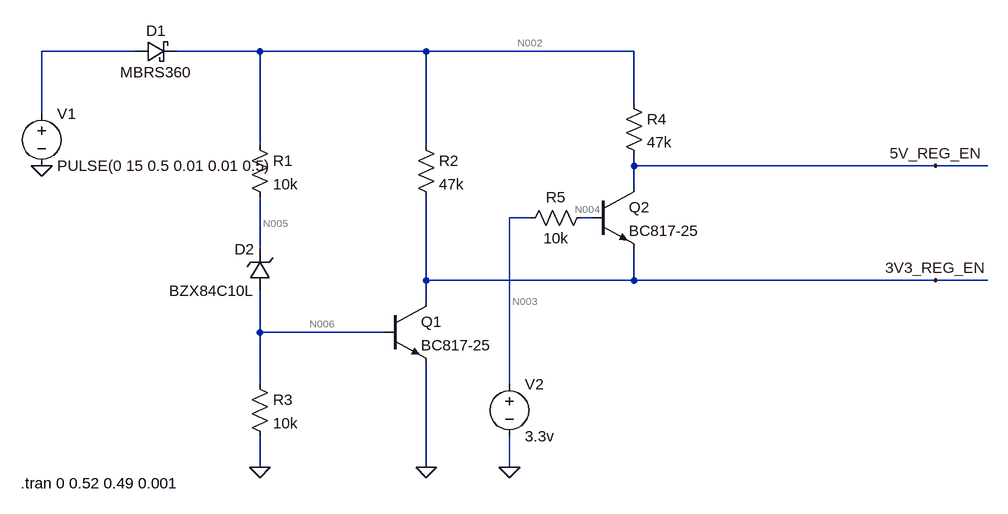
[diagram p0: schematic psu.asc]
psu.asc, the LTspice schematic file:
Version 4
SHEET 1 1500 696
WIRE 176 16 32 16
WIRE 368 16 240 16
WIRE 624 16 368 16
WIRE 944 16 624 16
WIRE 944 96 944 16
WIRE 32 112 32 16
WIRE 368 160 368 16
WIRE 624 160 624 16
WIRE 944 192 944 176
WIRE 1408 192 944 192
WIRE 1488 192 1408 192
WIRE 944 224 944 192
WIRE 784 272 752 272
WIRE 880 272 864 272
WIRE 368 320 368 240
WIRE 624 368 624 240
WIRE 944 368 944 320
WIRE 944 368 624 368
WIRE 1408 368 944 368
WIRE 1488 368 1408 368
WIRE 624 400 624 368
WIRE 368 448 368 384
WIRE 560 448 368 448
WIRE 368 528 368 448
WIRE 752 528 752 272
WIRE 368 656 368 608
WIRE 624 656 624 496
WIRE 752 656 752 608
FLAG 32 192 0
FLAG 368 656 0
FLAG 624 656 0
FLAG 1408 192 5V_REG_EN
FLAG 1408 368 3V3_REG_EN
FLAG 752 656 0
SYMBOL voltage 32 96 R0
WINDOW 123 0 0 Left 0
WINDOW 39 0 0 Left 0
SYMATTR InstName V1
SYMATTR Value PULSE(0 15 0.5 0.01 0.01 0.5)
SYMBOL schottky 176 32 R270
WINDOW 0 32 32 VTop 2
WINDOW 3 0 32 VBottom 2
SYMATTR InstName D1
SYMATTR Value MBRS360
SYMATTR Description Diode
SYMATTR Type diode
SYMBOL res 352 144 R0
SYMATTR InstName R1
SYMATTR Value 10k
SYMBOL res 608 144 R0
SYMATTR InstName R2
SYMATTR Value 47k
SYMBOL zener 384 384 R180
WINDOW 0 24 64 Left 2
WINDOW 3 24 0 Left 2
SYMATTR InstName D2
SYMATTR Value BZX84C10L
SYMATTR Description Diode
SYMATTR Type diode
SYMBOL res 352 512 R0
SYMATTR InstName R3
SYMATTR Value 10k
SYMBOL npn 560 400 R0
SYMATTR InstName Q1
SYMATTR Value BC817-25
SYMBOL npn 880 224 R0
SYMATTR InstName Q2
SYMATTR Value BC817-25
SYMBOL res 928 80 R0
SYMATTR InstName R4
SYMATTR Value 47k
SYMBOL res 880 256 R90
WINDOW 0 0 56 VBottom 2
WINDOW 3 32 56 VTop 2
SYMATTR InstName R5
SYMATTR Value 10k
SYMBOL voltage 752 512 R0
SYMATTR InstName V2
SYMATTR Value 3.3v
TEXT 0 680 Left 2 !.tran 0 0.52 0.49 0.001

The netlist it stands for:
* psu.asc
V1 N001 0 PULSE(0 15 0.5 0.01 0.01 0.5)
D1 N001 N002 MBRS360
R1 N002 N005 10k
R2 N002 3V3_REG_EN 47k
D2 N006 N005 BZX84C10L
R3 N006 0 10k
Q1 3V3_REG_EN N006 0 0 BC817-25
Q2 5V_REG_EN N004 3V3_REG_EN 0 BC817-25
R4 N002 5V_REG_EN 47k
R5 N004 N003 10k
V2 N003 0 3.3v
.model D D
.lib standard.dio
.model NPN NPN
.model PNP PNP
.lib standard.bjt
.tran 0 0.52 0.49 0.001
.backanno
.end

* Results of the author's LTspice run, read from the files saved beside the schematic
* Operating Point, zero values left out:
*   V(n002) = 1.964 V
*   V(n005) = 1.964 V
*   V(3v3_reg_en) = 2.495 V
*   V(n006) = 6.045 µV
*   V(5v_reg_en) = 2.496 V
*   V(n004) = 3.074 V
*   V(n003) = 3.3 V
*   Ic(Q1) = 2.599 pA
*   Ib(Q1) = -2.503 pA
*   Ic(Q2) = -11.31 µA
*   Ib(Q2) = 22.6 µA
*   Ie(Q2) = -11.29 µA
*   I(D1) = -22.6 µA
*   I(D2) = -602 pA
*   I(R1) = 602 pA
*   I(R2) = -11.29 µA
*   I(R3) = 604.5 pA
*   I(R4) = -11.31 µA
*   I(R5) = -22.6 µA
*   I(V1) = 22.6 µA
*   I(V2) = -22.6 µA
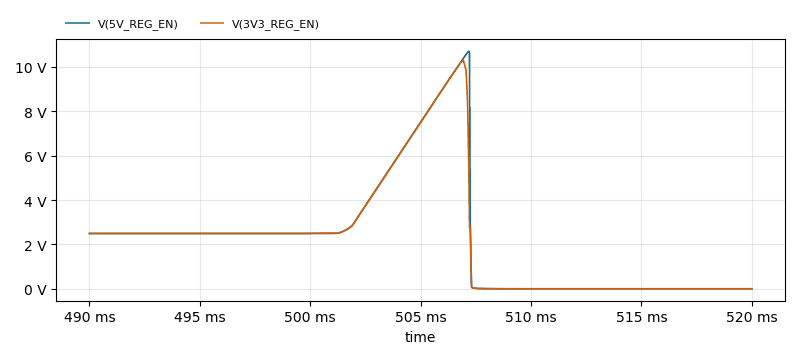
[diagram p1: Transient Analysis of psu.asc, plotted from the saved traces]
* Transient Analysis, 1 run:
*   V(5V_REG_EN): min 8.82 mV, max 10.69 V, average 2.217 V, rms 3.433 V, last 8.82 mV
*   V(3V3_REG_EN): min 5.288 mV, max 10.27 V, average 2.191 V, rms 3.378 V, last 5.288 mV